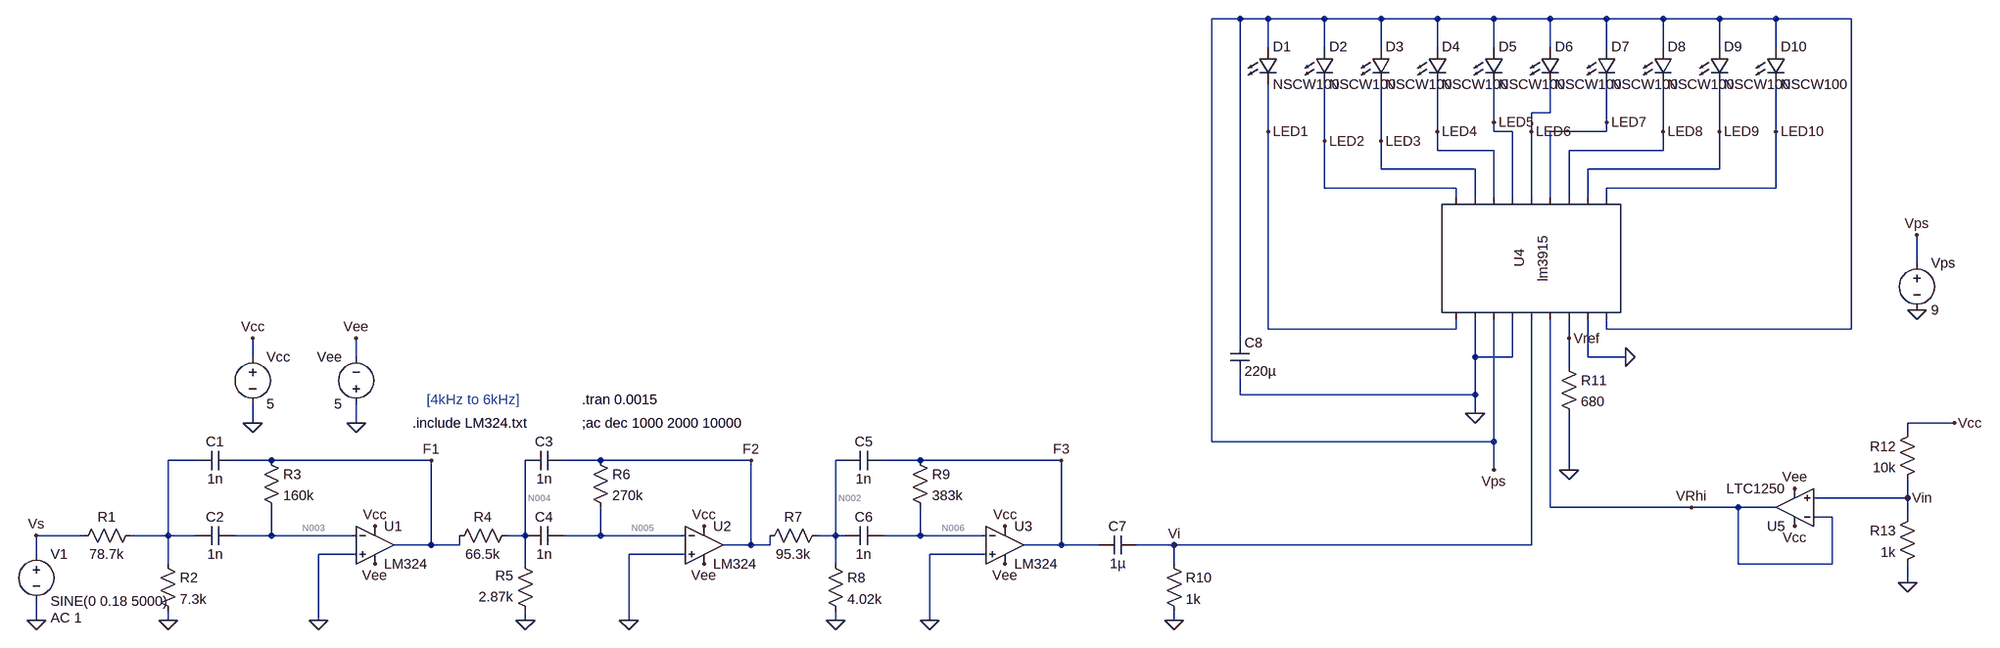
[diagram p0: schematic FinalPresenceFilterWithLEDDriver.asc]
* FinalPresenceFilterWithLEDDriver.asc
R1 N001 Vs 78.7k
V1 Vs 0 SINE(0 0.18 5000) AC 1
R3 F1 N003 160k
R4 N004 F1 66.5k
R5 0 N004 2.87k
R6 F2 N005 270k
R7 F2 N002 95.3k
R8 N002 0 4.02k
R9 F3 N006 383k
C1 F1 N001 1n
C2 N003 N001 1n
C3 F2 N004 1n
C4 N005 N004 1n
C5 F3 N002 1n
C6 N006 N002 1n
R2 N001 0 7.3k
Vcc Vcc 0 5
Vee 0 Vee 5
XU1 0 N003 Vcc Vee F1 LM324  ; pins In+ In- V+ V- OUT
XU2 0 N005 Vcc Vee F2 LM324  ; pins In+ In- V+ V- OUT
XU3 0 N006 Vcc Vee F3 LM324  ; pins In+ In- V+ V- OUT
C7 Vi F3 1µ
R10 Vi 0 1k
D1 Vps LED1 NSCW100
D2 Vps LED2 NSCW100
D3 Vps LED3 NSCW100
D4 Vps LED4 NSCW100
D5 Vps LED5 NSCW100
D6 Vps LED6 NSCW100
D7 Vps LED7 NSCW100
D8 Vps LED8 NSCW100
D9 Vps LED9 NSCW100
D10 Vps LED10 NSCW100
C8 Vps 0 220µ
Vps Vps 0 9
* U4: lm3915 (symbol AutoGenerated\lm3915 not available, pins judged from their places): pin1=LED1 pin2=0 pin3=Vps pin4=0 pin5=Vi pin6=VRhi pin7=Vref pin8=0 pin9=Vps pin10=LED2 pin11=LED3 pin12=LED4 pin13=LED5 pin14=LED6 pin15=LED7 pin16=LED8 pin17=LED9 pin18=LED10
R11 Vref 0 680
R12 Vcc Vin 10k
R13 Vin 0 1k
XU5 Vin VRhi Vcc Vee VRhi LTC1250  ; pins In+ In- V+ V- OUT
.model D D
.lib standard.dio
.tran 0.0015
;ac dec 1000 2000 10000
* [4kHz to 6kHz]
.include LM324.txt
.backanno
.end

* Results of the author's LTspice run, read from the files saved beside the schematic
* Operating Point, zero values left out:
*   V(f1) = -3.225 mV
*   V(n003) = -33.62 µV
*   V(n004) = -133.4 µV
*   V(f2) = -5.419 mV
*   V(n005) = -33.6 µV
*   V(n002) = -219.3 µV
*   V(f3) = -7.672 mV
*   V(n006) = -33.58 µV
*   V(vcc) = 5 V
*   V(vee) = -5 V
*   V(vi) = -25 µV
*   V(vps) = 9 V
*   V(led1) = 7.98 V
*   V(led2) = 7.98 V
*   V(led3) = 7.98 V
*   V(led4) = 7.98 V
*   V(led5) = 7.98 V
*   V(led6) = 7.98 V
*   V(led7) = 7.98 V
*   V(led8) = 7.98 V
*   V(led9) = 7.98 V
*   V(led10) = 7.98 V
*   V(vref) = 1.192 V
*   V(vrhi) = 454.5 mV
*   V(vin) = 454.5 mV
*   I(D10) = 1 µA
*   I(D9) = 1 µA
*   I(D8) = 1 µA
*   I(D7) = 1 µA
*   I(D6) = 1 µA
*   I(D5) = 1 µA
*   I(D4) = 1 µA
*   I(D3) = 1 µA
*   I(D2) = 1 µA
*   I(D1) = 1 µA
*   I(R13) = 454.5 µA
*   I(R12) = 454.5 µA
*   I(R11) = 1.753 mA
*   I(R10) = -25 nA
*   I(R9) = -19.94 nA
*   I(R8) = -54.56 nA
*   I(R7) = -54.56 nA
*   I(R6) = -19.94 nA
*   I(R5) = 46.49 nA
*   I(R4) = 46.49 nA
*   I(R3) = -19.94 nA
*   I(Vps) = -10.45 mA
*   I(Vee) = -4.012 mA
*   I(Vcc) = -4.483 mA
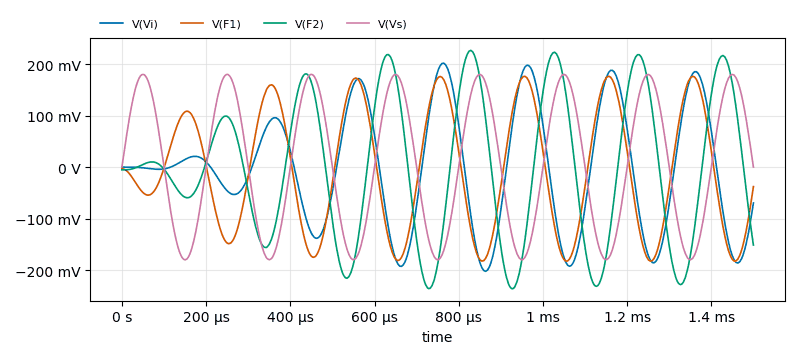
[diagram p1: Transient Analysis of FinalPresenceFilterWithLEDDriver.asc, plotted from the saved traces]
* Transient Analysis, 1 run:
*   V(Vi): min -202.4 mV, max 201.7 mV, average -3.685 mV, rms 114.8 mV, last -69.79 mV
*   V(F1): min -182.7 mV, max 176.3 mV, average -6.95 mV, rms 117.5 mV, last -37.92 mV
*   V(F2): min -236.3 mV, max 226.6 mV, average -1.866 mV, rms 138.5 mV, last -151.3 mV
*   V(Vs): min -180 mV, max 180 mV, average 7.634 mV, rms 127.2 mV, last 0 V